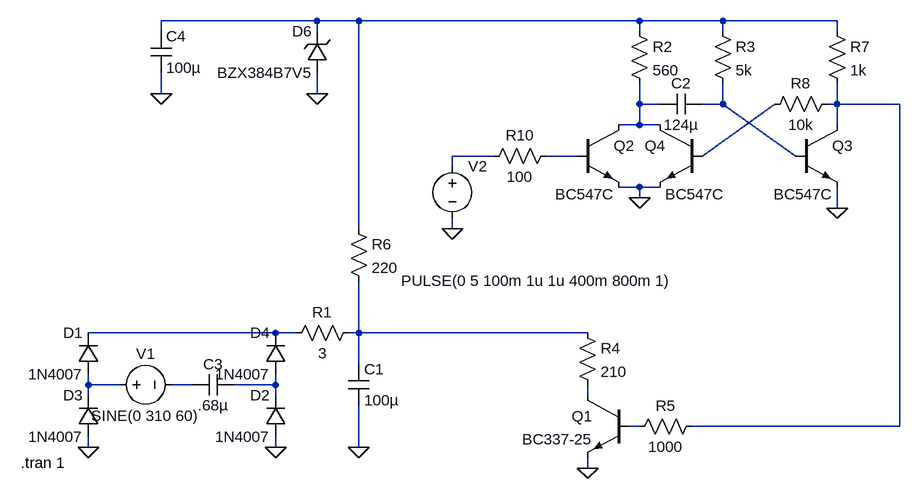
[diagram p0: schematic Temporizador.asc]
Temporizador.asc, the LTspice schematic file:
Version 4
SHEET 1 1464 680
WIRE 320 -400 80 -400
WIRE 384 -400 320 -400
WIRE 816 -400 384 -400
WIRE 944 -400 816 -400
WIRE 1120 -400 944 -400
WIRE 80 -384 80 -400
WIRE 320 -384 320 -400
WIRE 816 -384 816 -400
WIRE 944 -384 944 -400
WIRE 1120 -384 1120 -400
WIRE 80 -288 80 -320
WIRE 320 -288 320 -320
WIRE 816 -272 816 -304
WIRE 848 -272 816 -272
WIRE 944 -272 944 -304
WIRE 944 -272 912 -272
WIRE 1120 -272 1120 -304
WIRE 1120 -272 1104 -272
WIRE 1216 -272 1120 -272
WIRE 816 -240 816 -272
WIRE 816 -240 784 -240
WIRE 848 -240 816 -240
WIRE 1120 -240 1120 -272
WIRE 592 -192 528 -192
WIRE 720 -192 672 -192
WIRE 912 -192 1024 -272
WIRE 1056 -192 944 -272
WIRE 528 -176 528 -192
WIRE 816 -144 784 -144
WIRE 848 -144 816 -144
WIRE 816 -128 816 -144
WIRE 1120 -112 1120 -144
WIRE 384 -80 384 -400
WIRE 528 -80 528 -96
WIRE 256 80 -32 80
WIRE 288 80 256 80
WIRE 384 80 384 0
WIRE 384 80 368 80
WIRE 736 80 384 80
WIRE 384 128 384 80
WIRE -32 160 -32 144
WIRE 16 160 -32 160
WIRE 128 160 96 160
WIRE 256 160 256 144
WIRE 256 160 192 160
WIRE -32 176 -32 160
WIRE 256 176 256 160
WIRE 736 176 736 160
WIRE 816 224 800 224
WIRE 1216 224 1216 -272
WIRE 1216 224 896 224
WIRE -32 256 -32 240
WIRE 256 256 256 240
WIRE 384 256 384 192
WIRE 736 288 736 272
FLAG -32 256 0
FLAG 256 256 0
FLAG 384 256 0
FLAG 736 288 0
FLAG 528 -80 0
FLAG 320 -288 0
FLAG 80 -288 0
FLAG 816 -128 0
FLAG 1120 -112 0
SYMBOL voltage 0 160 R270
WINDOW 0 32 56 VTop 2
WINDOW 3 -32 56 VBottom 2
WINDOW 123 0 0 Left 2
WINDOW 39 0 0 Left 2
SYMATTR InstName V1
SYMATTR Value SINE(0 310 60)
SYMBOL diode -16 144 R180
WINDOW 0 24 64 Left 2
WINDOW 3 24 0 Left 2
SYMATTR InstName D1
SYMATTR Value 1N4007
SYMBOL diode -16 240 R180
WINDOW 0 24 64 Left 2
WINDOW 3 24 0 Left 2
SYMATTR InstName D3
SYMATTR Value 1N4007
SYMBOL res 384 64 R90
WINDOW 0 0 56 VBottom 2
WINDOW 3 32 56 VTop 2
SYMATTR InstName R1
SYMATTR Value 3
SYMBOL cap 368 128 R0
SYMATTR InstName C1
SYMATTR Value 100µ
SYMATTR SpiceLine V=50
SYMBOL diode 272 240 R180
WINDOW 0 24 64 Left 2
WINDOW 3 24 0 Left 2
SYMATTR InstName D2
SYMATTR Value 1N4007
SYMBOL diode 272 144 R180
WINDOW 0 24 64 Left 2
WINDOW 3 24 0 Left 2
SYMATTR InstName D4
SYMATTR Value 1N4007
SYMBOL cap 192 144 R90
WINDOW 0 0 32 VBottom 2
WINDOW 3 32 32 VTop 2
SYMATTR InstName C3
SYMATTR Value .68µ
SYMBOL res 720 64 R0
SYMATTR InstName R4
SYMATTR Value 210
SYMBOL npn 800 176 M0
SYMATTR InstName Q1
SYMATTR Value BC337-25
SYMBOL res 912 208 R90
WINDOW 0 0 56 VBottom 2
WINDOW 3 32 56 VTop 2
SYMATTR InstName R5
SYMATTR Value 1000
SYMBOL voltage 528 -192 R0
WINDOW 3 -79 192 Left 2
WINDOW 123 0 0 Left 2
WINDOW 39 0 0 Left 2
SYMATTR Value PULSE(0 5 100m 1u 1u 400m 800m 1)
SYMATTR InstName V2
SYMBOL res 368 -96 R0
SYMATTR InstName R6
SYMATTR Value 220
SYMATTR SpiceLine pwr=1
SYMBOL cap 64 -384 R0
SYMATTR InstName C4
SYMATTR Value 100µ
SYMATTR SpiceLine V=25
SYMBOL zener 336 -320 R180
WINDOW 0 24 64 Left 2
WINDOW 3 24 0 Left 2
SYMATTR InstName D6
SYMATTR Value BZX384B7V5
SYMATTR Description Diode
SYMATTR Type diode
SYMBOL res 800 -400 R0
SYMATTR InstName R2
SYMATTR Value 560
SYMBOL res 928 -400 R0
SYMATTR InstName R3
SYMATTR Value 5k
SYMBOL res 1104 -400 R0
SYMATTR InstName R7
SYMATTR Value 1k
SYMBOL res 1120 -288 R90
WINDOW 0 0 56 VBottom 2
WINDOW 3 32 56 VTop 2
SYMATTR InstName R8
SYMATTR Value 10k
SYMBOL cap 912 -288 R90
WINDOW 0 0 32 VBottom 2
WINDOW 3 32 32 VTop 2
SYMATTR InstName C2
SYMATTR Value 124µ
SYMATTR SpiceLine V=25
SYMBOL res 688 -208 R90
WINDOW 0 0 56 VBottom 2
WINDOW 3 32 56 VTop 2
SYMATTR InstName R10
SYMATTR Value 100
SYMBOL npn 720 -240 R0
WINDOW 3 -34 107 Left 2
SYMATTR Value BC547C
SYMATTR InstName Q2
SYMBOL npn 1056 -240 R0
WINDOW 3 -34 107 Left 2
SYMATTR Value BC547C
SYMATTR InstName Q3
SYMBOL npn 912 -240 M0
WINDOW 3 -34 107 Left 2
SYMATTR Value BC547C
SYMATTR InstName Q4
TEXT -136 280 Left 2 !.tran 1

The netlist it stands for:
* Temporizador.asc
V1 N010 N011 SINE(0 310 60)
D1 N010 N008 1N4007
D3 0 N010 1N4007
R1 N009 N008 3
C1 N009 0 100µ V=50
D2 0 N012 1N4007
D4 N012 N008 1N4007
C3 N012 N011 .68µ
R4 N009 N013 210
Q1 N013 N014 0 0 BC337-25
R5 N004 N014 1000
V2 N005 0 PULSE(0 5 100m 1u 1u 400m 800m 1)
R6 N001 N009 220 pwr=1
C4 N001 0 100µ V=25
D6 0 N001 BZX384B7V5
R2 N001 N002 560
R3 N001 N003 5k
R7 N001 N004 1k
R8 N004 N007 10k
C2 N003 N002 124µ V=25
R10 N006 N005 100
Q2 N002 N006 0 0 BC547C
Q3 N004 N003 0 0 BC547C
Q4 N002 N007 0 0 BC547C
.model D D
.lib standard.dio
.model NPN NPN
.model PNP PNP
.lib standard.bjt
.tran 1
.backanno
.end